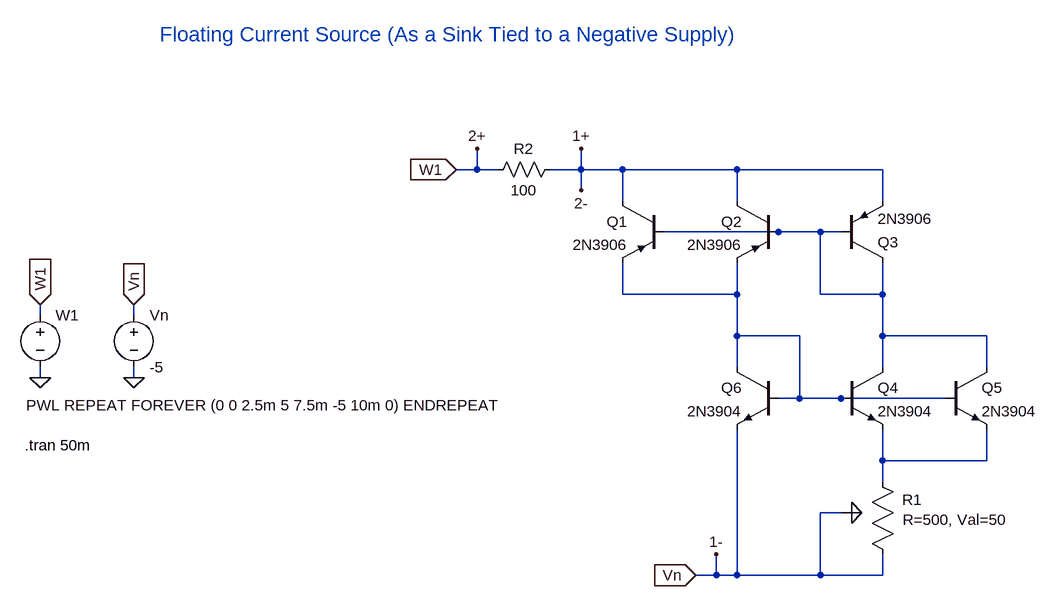
[diagram p0: schematic float_curr_src_vn_ltspice.asc]
float_curr_src_vn_ltspice.asc, the LTspice schematic file:
Version 4
SHEET 1 1096 1076
WIRE 96 272 96 240
WIRE 96 272 64 272
WIRE 128 272 96 272
WIRE 256 272 256 240
WIRE 256 272 208 272
WIRE 320 272 256 272
WIRE 496 272 320 272
WIRE 720 272 496 272
WIRE 256 304 256 272
WIRE 320 320 320 272
WIRE 496 320 496 272
WIRE 720 320 720 272
WIRE 560 368 384 368
WIRE 624 368 560 368
WIRE 656 368 624 368
WIRE 320 464 320 416
WIRE 496 464 496 416
WIRE 496 464 320 464
WIRE 624 464 624 368
WIRE 720 464 720 416
WIRE 720 464 624 464
WIRE -576 496 -576 480
WIRE -432 496 -432 480
WIRE 496 528 496 464
WIRE 592 528 496 528
WIRE 720 528 720 464
WIRE 880 528 720 528
WIRE 496 576 496 528
WIRE 720 576 720 528
WIRE 880 576 880 528
WIRE -576 592 -576 576
WIRE -432 592 -432 576
WIRE 592 624 592 528
WIRE 592 624 560 624
WIRE 656 624 592 624
WIRE 816 624 656 624
WIRE 720 720 720 672
WIRE 880 720 880 672
WIRE 880 720 720 720
WIRE 720 752 720 720
WIRE 656 800 624 800
WIRE 464 896 464 864
WIRE 464 896 432 896
WIRE 496 896 496 672
WIRE 496 896 464 896
WIRE 624 896 624 800
WIRE 624 896 496 896
WIRE 720 896 720 864
WIRE 720 896 624 896
FLAG 64 272 W1
IOPIN 64 272 In
FLAG 432 896 Vn
IOPIN 432 896 In
FLAG 256 240 1+
FLAG 256 304 2-
FLAG 464 864 1-
FLAG -576 592 0
FLAG 96 240 2+
FLAG -432 592 0
FLAG -576 480 W1
IOPIN -576 480 In
FLAG -432 480 Vn
IOPIN -432 480 In
SYMBOL pnp 384 320 M0
SYMATTR InstName Q1
SYMATTR Value 2N3906
SYMBOL pnp 560 320 M0
SYMATTR InstName Q2
SYMATTR Value 2N3906
SYMBOL pnp 656 416 M180
SYMATTR InstName Q3
SYMATTR Value 2N3906
SYMBOL npn 656 576 R0
SYMATTR InstName Q4
SYMATTR Value 2N3904
SYMBOL npn 816 576 R0
SYMATTR InstName Q5
SYMATTR Value 2N3904
SYMBOL res 224 256 R90
WINDOW 0 0 56 VBottom 2
WINDOW 3 32 56 VTop 2
SYMATTR InstName R2
SYMATTR Value 100
SYMBOL potentiometer 704 768 R0
WINDOW 0 46 12 Left 2
WINDOW 39 47 43 Left 2
SYMATTR InstName R1
SYMATTR SpiceLine R=500, Val=50
SYMBOL npn 560 576 M0
SYMATTR InstName Q6
SYMATTR Value 2N3904
SYMBOL voltage -576 480 R0
WINDOW 3 -22 155 Left 2
SYMATTR Value PWL REPEAT FOREVER (0 0 2.5m 5 7.5m -5 10m 0) ENDREPEAT
SYMATTR InstName W1
SYMBOL voltage -432 480 R0
SYMATTR InstName Vn
SYMATTR Value -5
TEXT -392 64 Left 3 ;Floating Current Source (As a Sink Tied to a Negative Supply)
TEXT -600 696 Left 2 !.tran 50m

The netlist it stands for:
* float_curr_src_vn_ltspice.asc
Q1 2- N001 N002 0 2N3906
Q2 2- N001 N002 0 2N3906
Q3 N001 N001 2- 0 2N3906
Q4 N001 N002 N003 0 2N3904
Q5 N001 N002 N003 0 2N3904
R2 2- 2+ 100
XR1 N003 1- 1- potentiometer R=500, Val=50  ; pins 1 2 3
Q6 N002 N002 1- 0 2N3904
V§W1 2+ 0 PWL REPEAT FOREVER (0 0 2.5m 5 7.5m -5 10m 0) ENDREPEAT
Vn 1- 0 -5
.model NPN NPN
.model PNP PNP
.lib standard.bjt
* Floating Current Source (As a Sink Tied to a Negative Supply)
.tran 50m
.backanno
.end